# Altium project 驱动模块.PrjPcb
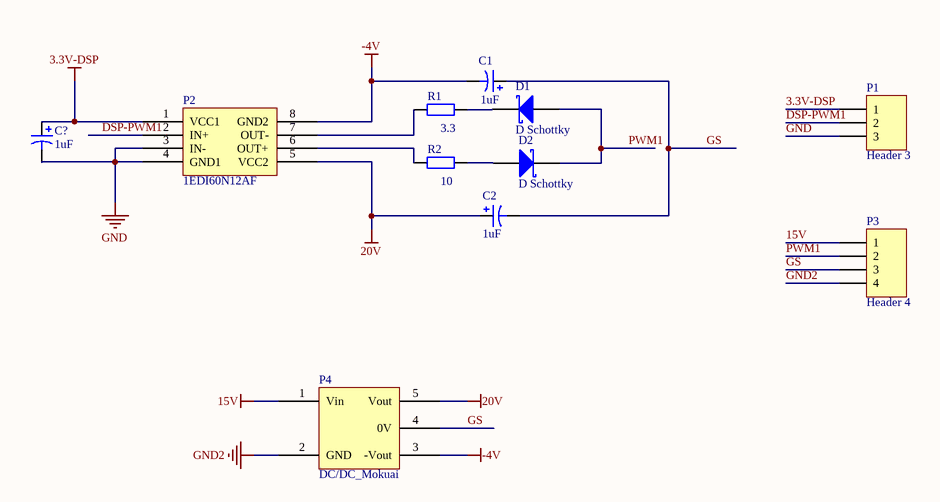
[diagram p0: Sheet1.SchDoc]
1 sheet, 11 parts. Net scope: global (net labels, ports and power ports of the same name join across sheets).
Board file: PCB1.PcbDoc

## Sheet Sheet1.SchDoc
size A4; SheetNumber: 1; SheetTotal: 1

### Parts
C1  value 1uF  [C-10uF]  (hidden comment: Cap Pol1)
C2  value 1uF  [C-10uF]  (hidden comment: Cap Pol1)
C?  value 1uF  (hidden comment: Cap Pol1)
D1  D Schottky  [Diode]
D2  D Schottky  [Diode]
P1  Header 3  [3_DuanZi]
P2  1EDI60N12AF  [sop-8]
P3  Header 4  [4_DuanZi]
P4  DC/DC_Mokuai  [DC/DC_MoKuai]
R1  value 3.3  [AXIAL-0.4]  (hidden comment: Res2)
R2  value 10  [AXIAL-0.4]  (hidden comment: Res2)

### Nets
3.3V-DSP: C?.1 P1.1 P2.1(VCC1)
15V: P3.1 P4.1(Vin)
20V: C2.1 P2.5(VCC2) P4.5(Vout)
-4V: C1.2 P2.8(GND2) P4.3(-Vout)
GND: C?.2 P1.3 P2.3(IN-) P2.4(GND1)
GND2: P3.4 P4.2(GND)
DSP-PWM1: P1.2 P2.2(IN+)
GS: C1.1 C2.2 P3.3 P4.4(0V)
PWM1: D1.1(A) D2.2(K) P3.2
NetD1_2: D1.2(K) R1.2
NetD2_1: D2.1(A) R2.2
NetP2_6: P2.6(OUT+) R2.1
NetP2_7: P2.7(OUT-) R1.1

### Library data of the parts
C1 C2 C? = Cap Pol1: Polarized Capacitor (Radial); Published: 8-Jun-2000; LatestRevisionDate: 17-Jul-2002; LatestRevisionNote: Re-released for DXP Platform.; PackageReference: RB7.6-15; Publisher: Altium Limited; PackageDescription: Polarized Capacitor (Radial); 2 Leads
D1 D2 = D Schottky: Schottky Diode; Published: 8-Jun-2000; LatestRevisionDate: 17-Jul-2002; LatestRevisionNote: Re-released for DXP Platform.; PackageReference: SMB; Publisher: Altium Limited; PackageDescription: DO-214-AA/SMB; 2 C-Bend Leads; Body 5.3 x 3.6 mm, inc. leads (LxW); Code_JEDEC: DO-214-AA
P1 = Header 3: Header, 3-Pin; LatestRevisionDate: 17-Jul-2002; LatestRevisionNote: Re-released for DXP Platform.; Publisher: Altium Limited
P3 = Header 4: Header, 4-Pin; LatestRevisionDate: 17-Jul-2002; LatestRevisionNote: Re-released for DXP Platform.; Publisher: Altium Limited
R1 R2 = Res2: Resistor; Published: 8-Jun-2000; LatestRevisionDate: 17-Jul-2002; LatestRevisionNote: Re-released for DXP Platform.; PackageReference: AXIAL-0.4; Publisher: Altium Limited; PackageDescription: Axial Device, Thru-Hole; 2 Leads; 0.4 in Pin Spacing